# EasyEDA schematic FFB_Arduino_Yoke_1.3_Micro.json
TITLE: FFB Arduino Yoke; REV: 1.3; Date: 04.03.2023; Sheet: 1/1; Company: Gagagu
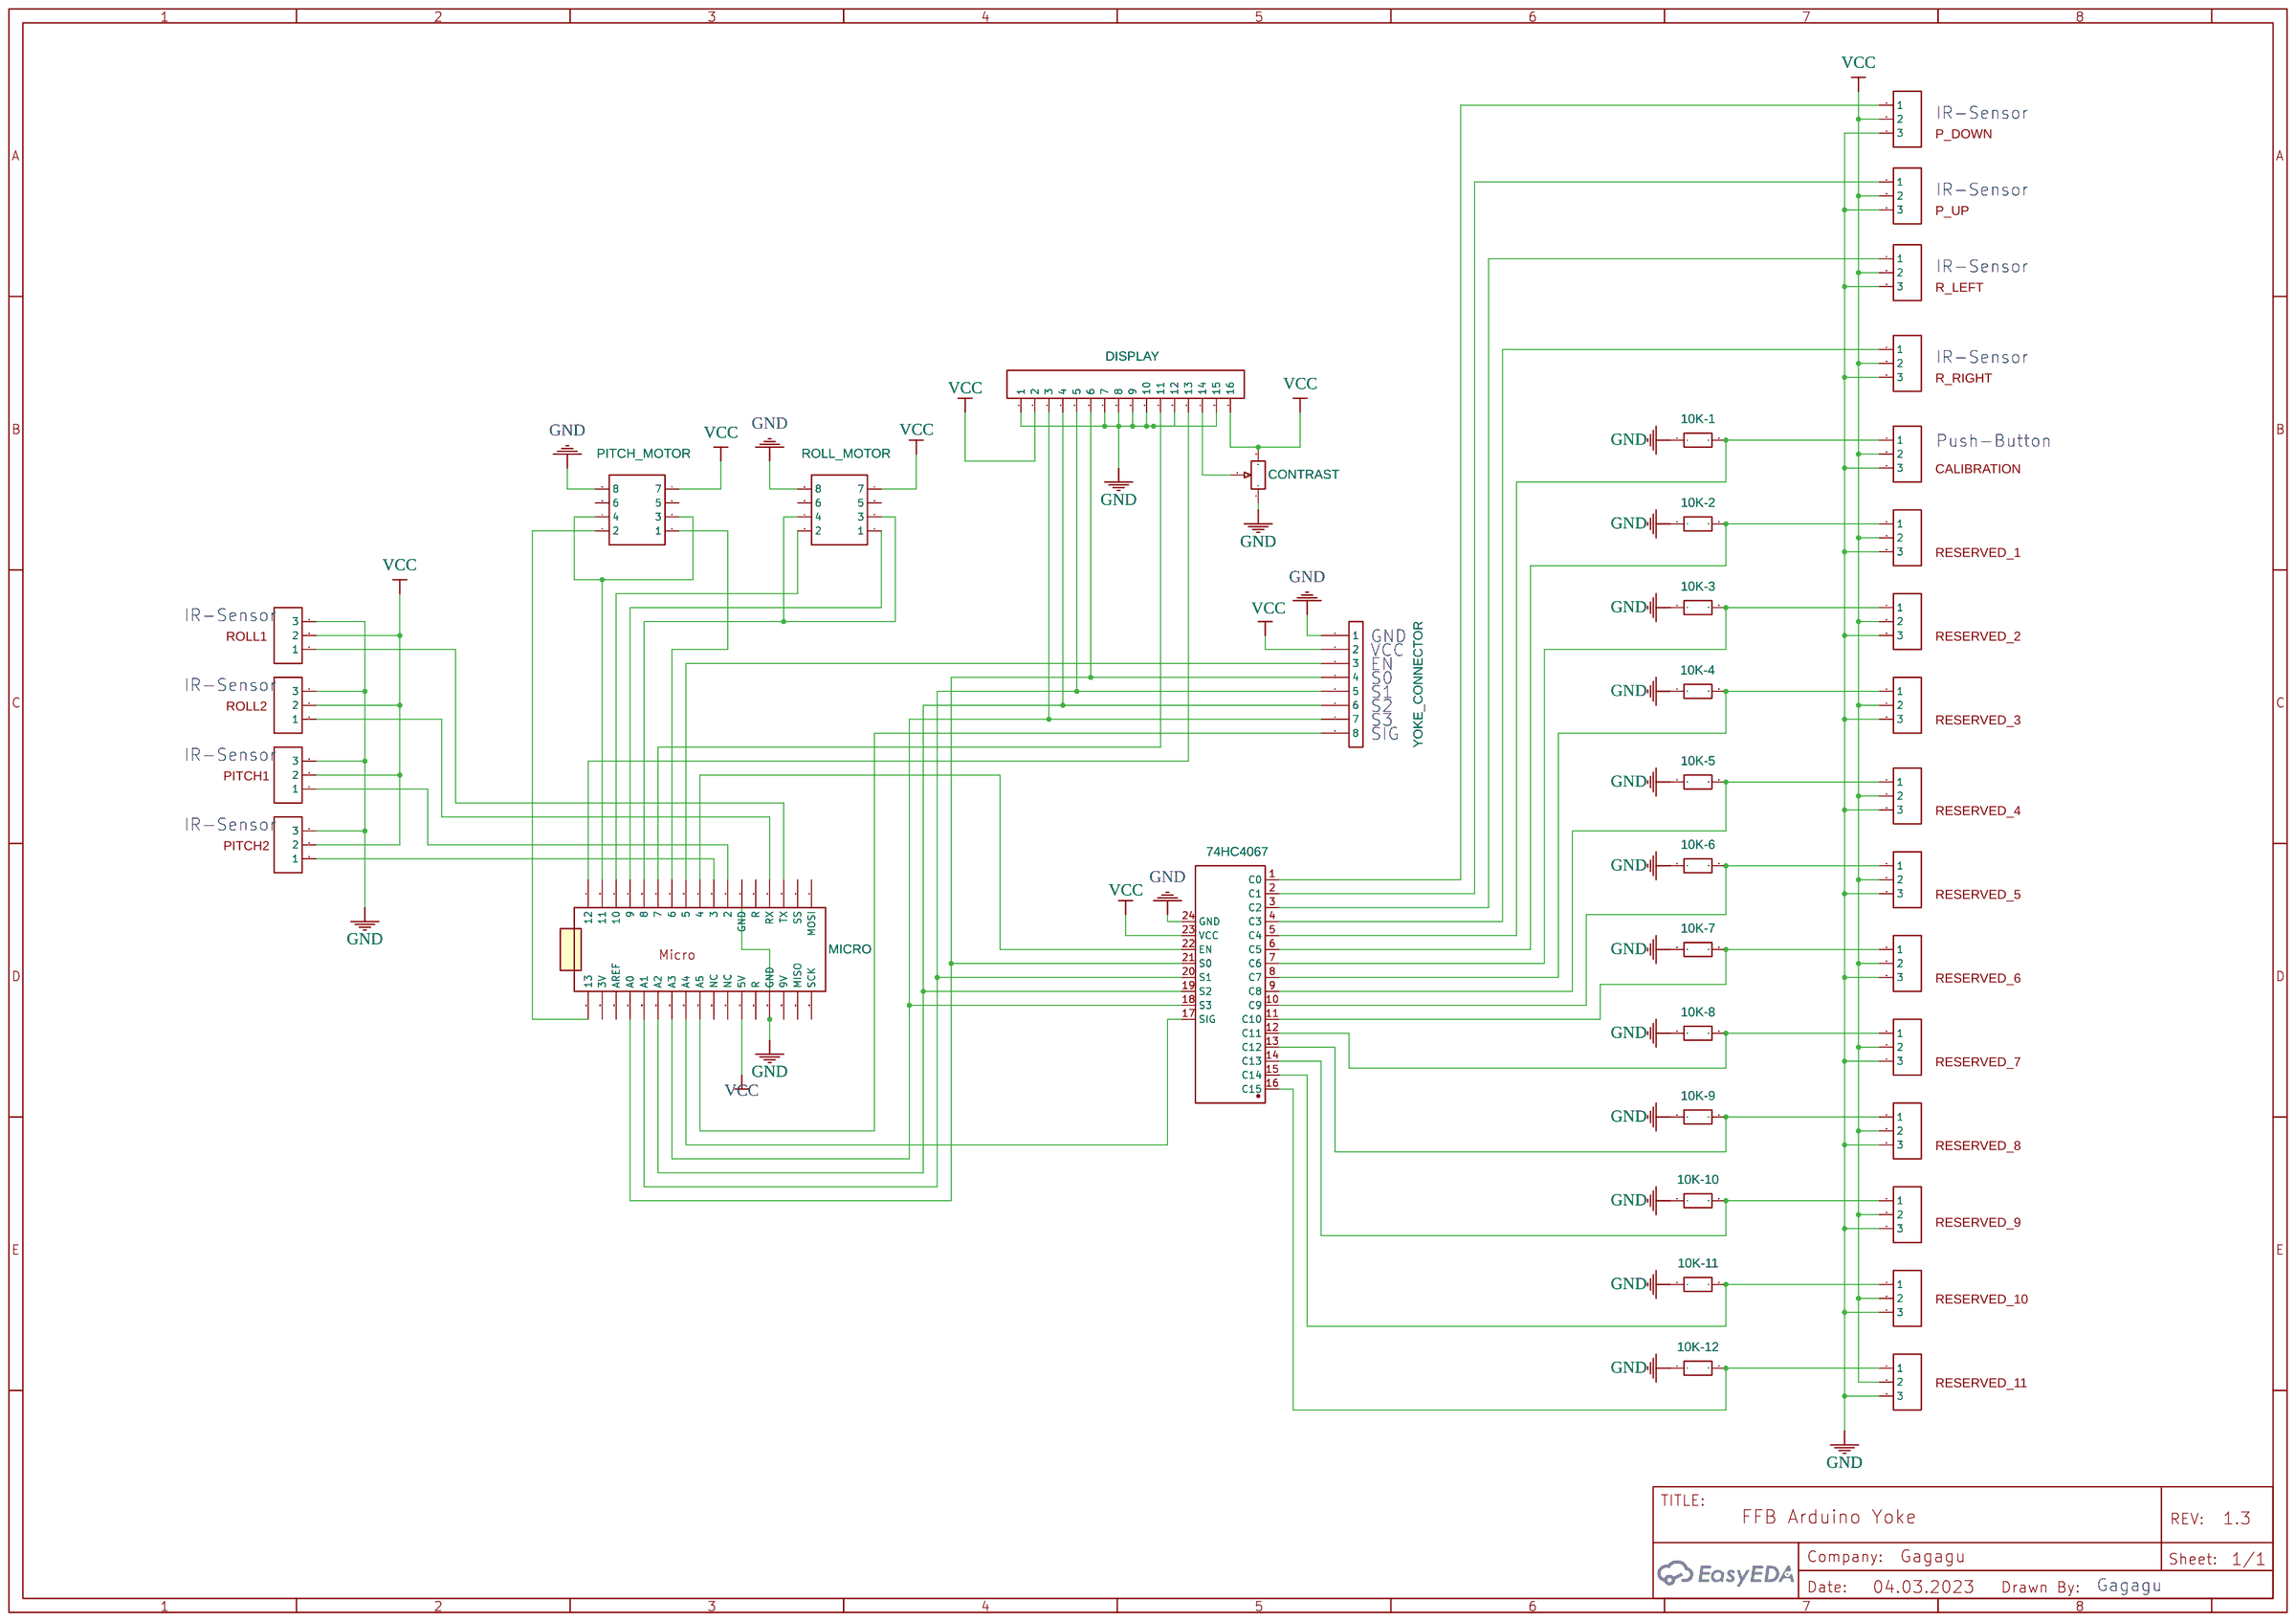
[diagram p0: schematic sheet]

## Parts
10K-1  10k  [R_AXIAL-0.4]
10K-2  10k  [R_AXIAL-0.4]
10K-3  10k  [R_AXIAL-0.4]
10K-4  10k  [R_AXIAL-0.4]
10K-5  10k  [R_AXIAL-0.4]
10K-6  10k  [R_AXIAL-0.4]
10K-7  10k  [R_AXIAL-0.4]
10K-8  10k  [R_AXIAL-0.4]
10K-9  10k  [R_AXIAL-0.4]
10K-10  10k  [R_AXIAL-0.4]
10K-11  10k  [R_AXIAL-0.4]
10K-12  10k  [R_AXIAL-0.4]
74HC4067  MUX CD74HC4067  [16-KANAL ANALOG/DIGITAL MULTIPLEXER MUX CD74HC4067]
CALIBR.  Multiturn POT 10K  [HDR-F-2.54_1X3]
CONTRAST  R_3386P_EU  [RES-ADJ-TH_3386P]
DISPLAY  HDR-M-2.54_1x16  [HDR-M-2.54_1X16]
MICRO  ARDUINOMICRO  [ARDUINOMICRO]
P_DOWN  Multiturn POT 10K  [HDR-F-2.54_1X3]
P_UP  Multiturn POT 10K  [HDR-F-2.54_1X3]
PITCH1  Multiturn POT 10K  [HDR-F-2.54_1X3]
PITCH2  Multiturn POT 10K  [HDR-F-2.54_1X3]
PITCH_MOTOR  HDR-F-2.54_2x4  [HDR-F-2.54_2X4]
R_LEFT  Multiturn POT 10K  [HDR-F-2.54_1X3]
R_RIGHT  Multiturn POT 10K  [HDR-F-2.54_1X3]
RES_1  Multiturn POT 10K  [HDR-F-2.54_1X3]
RES_2  Multiturn POT 10K  [HDR-F-2.54_1X3]
RES_3  Multiturn POT 10K  [HDR-F-2.54_1X3]
RES_4  Multiturn POT 10K  [HDR-F-2.54_1X3]
RES_5  Multiturn POT 10K  [HDR-F-2.54_1X3]
RES_6  Multiturn POT 10K  [HDR-F-2.54_1X3]
RES_7  Multiturn POT 10K  [HDR-F-2.54_1X3]
RES_8  Multiturn POT 10K  [HDR-F-2.54_1X3]
RES_9  Multiturn POT 10K  [HDR-F-2.54_1X3]
RES_10  Multiturn POT 10K  [HDR-F-2.54_1X3]
RES_11  Multiturn POT 10K  [HDR-F-2.54_1X3]
ROLL1  Multiturn POT 10K  [HDR-F-2.54_1X3]
ROLL2  Multiturn POT 10K  [HDR-F-2.54_1X3]
ROLL_MOTOR  HDR-F-2.54_2x4  [HDR-F-2.54_2X4]
YOKE_CONNECTOR  Yoke Connector  [DUPONT_1X8]

## Library data of the parts
10K-1-10K-12 = R_AXIAL-0.3_EU: Contributor: LCEDA_Lib
74HC4067 = 16-Kanal Analog/Digital Multiplexer MUX CD74HC4067: Supplier: Bastelgarage; Supplier Part: 420243; link: https://www.bastelgarage.ch/16-kanal-analog-digital-multiplexer-mux-cd74hc4067?search=420243; Contributor: Lemon Six
CALIBR. P_DOWN P_UP PITCH1 PITCH2 R_LEFT R_RIGHT RES_1-RES_11 ROLL1 ROLL2 = HDR-F-2.54_1x3: Supplier Part: C146690; Supplier: LCSC; Contributor: Scikraft; Package Display: No
CONTRAST = R_3386P_EU: Supplier: LCSC; Contributor: LCEDA_Lib; Value(Ω): 10K
DISPLAY = HDR-M-2.54_1x16: Supplier: LCSC; Contributor: LCEDA_Lib
MICRO = ARDUINOMICRO: Contributor: noobieman21
PITCH_MOTOR ROLL_MOTOR = HDR-F-2.54_2x4: Supplier Part: C239344; Supplier: LCSC; Contributor: LCEDA_Lib
YOKE_CONNECTOR = DUPONT_1X8: Manufacturer Part: Conector_dupont; Contributor: invenitec

## Nets
GND: 10K-1.1 10K-2.1 10K-3.1 10K-4.1 10K-5.1 10K-6.1 10K-7.1 10K-8.1 10K-9.1 10K-10.1 10K-11.1 10K-12.1 74HC4067.24(GND) CALIBR..3 CONTRAST.1 DISPLAY.1 DISPLAY.7 DISPLAY.8 DISPLAY.9 DISPLAY.10 DISPLAY.12 DISPLAY.15 MICRO.P$12(GND) MICRO.P$21(GND) P_DOWN.3 P_UP.3 PITCH1.3 PITCH2.3 PITCH_MOTOR.8 R_LEFT.3 R_RIGHT.3 RES_1.3 RES_2.3 RES_3.3 RES_4.3 RES_5.3 RES_6.3 RES_7.3 RES_8.3 RES_9.3 RES_10.3 RES_11.3 ROLL1.3 ROLL2.3 ROLL_MOTOR.8 YOKE_CONNECTOR.1
VCC: 74HC4067.23(VCC) CALIBR..2 CONTRAST.3 DISPLAY.2 DISPLAY.16 MICRO.P$23(5V) P_DOWN.2 P_UP.2 PITCH1.2 PITCH2.2 PITCH_MOTOR.7 R_LEFT.2 R_RIGHT.2 RES_1.2 RES_2.2 RES_3.2 RES_4.2 RES_5.2 RES_6.2 RES_7.2 RES_8.2 RES_9.2 RES_10.2 RES_11.2 ROLL1.2 ROLL2.2 ROLL_MOTOR.7 YOKE_CONNECTOR.2
Net-(10K-1-2): 10K-1.2 74HC4067.5(C4) CALIBR..1
Net-(10K-2-2): 10K-2.2 74HC4067.6(C5) RES_1.1
Net-(10K-3-2): 10K-3.2 74HC4067.7(C6) RES_2.1
Net-(10K-4-2): 10K-4.2 74HC4067.8(C7) RES_3.1
Net-(10K-5-2): 10K-5.2 74HC4067.9(C8) RES_4.1
Net-(10K-6-2): 10K-6.2 74HC4067.10(C9) RES_5.1
Net-(10K-7-2): 10K-7.2 74HC4067.11(C10) RES_6.1
Net-(10K-8-2): 10K-8.2 74HC4067.12(C11) RES_7.1
Net-(10K-9-2): 10K-9.2 74HC4067.13(C12) RES_8.1
Net-(10K-10-2): 10K-10.2 74HC4067.14(C13) RES_9.1
Net-(10K-11-2): 10K-11.2 74HC4067.15(C14) RES_10.1
Net-(10K-12-2): 10K-12.2 74HC4067.16(C15) RES_11.1
Net-(74HC4067-1): 74HC4067.1(C0) P_DOWN.1
Net-(74HC4067-2): 74HC4067.2(C1) P_UP.1
Net-(74HC4067-3): 74HC4067.3(C2) R_LEFT.1
Net-(74HC4067-4): 74HC4067.4(C3) R_RIGHT.1
Net-(74HC4067-17): 74HC4067.17(SIG) MICRO.P$27(A4)
Net-(74HC4067-18): 74HC4067.18(S3) DISPLAY.3 MICRO.P$28(A3) YOKE_CONNECTOR.7
Net-(74HC4067-19): 74HC4067.19(S2) DISPLAY.4 MICRO.P$29(A2) YOKE_CONNECTOR.6
Net-(74HC4067-20): 74HC4067.20(S1) DISPLAY.5 MICRO.P$30(A1) YOKE_CONNECTOR.5
Net-(74HC4067-21): 74HC4067.21(S0) DISPLAY.6 MICRO.P$31(A0) YOKE_CONNECTOR.4
Net-(74HC4067-22): 74HC4067.22(EN) MICRO.P$9(4)
Net-(CONTRAST-2): CONTRAST.2 DISPLAY.14
Net-(DISPLAY-11): DISPLAY.11 MICRO.P$6(7)
Net-(DISPLAY-13): DISPLAY.13 MICRO.P$1(12)
Net-(MICRO-P$2): MICRO.P$2(11) PITCH_MOTOR.3 PITCH_MOTOR.4
Net-(MICRO-P$3): MICRO.P$3(10) ROLL_MOTOR.2
Net-(MICRO-P$4): MICRO.P$4(9) ROLL_MOTOR.1
Net-(MICRO-P$5): MICRO.P$5(8) ROLL_MOTOR.3 ROLL_MOTOR.4
Net-(MICRO-P$7): MICRO.P$7(6) PITCH_MOTOR.1
Net-(MICRO-P$8): MICRO.P$8(5) YOKE_CONNECTOR.3
Net-(MICRO-P$10): MICRO.P$10(3) PITCH2.1
Net-(MICRO-P$11): MICRO.P$11(2) PITCH1.1
Net-(MICRO-P$14): MICRO.P$14(RX) ROLL2.1
Net-(MICRO-P$15): MICRO.P$15(TX) ROLL1.1
Net-(MICRO-P$26): MICRO.P$26(A5) YOKE_CONNECTOR.8
Net-(MICRO-P$34): MICRO.P$34(13) PITCH_MOTOR.2

Not connected (* = marked no-connect by the designer): MICRO P$13(R) P$16(SS) P$17(MOSI) P$18(SCK) P$19(MISO) P$20(9V) P$22(R) P$24(NC) P$25(NC) P$32(AREF) P$33(3V); PITCH_MOTOR 5 6; ROLL_MOTOR 5 6

## Notes on the sheet
- IR-Sensor
- IR-Sensor
- IR-Sensor
- IR-Sensor
- Push-Button
- IR-Sensor
- GND
- EN
- VCC
- S0
- IR-Sensor
- S1
- S2
- S3
- SIG
- IR-Sensor
- IR-Sensor
- Gagagu
